# Altium schematic sheet 2_MCU.schdoc.schdoc
size 309 x 223 mm; Symbol: Sheet-Symbol_A4; Device: Sheet-Symbol_A4; Company: 嘉立创EDA; Drawed: 吴登珂; Version: V1.0; Page Size: A4; @Project Name: 最小系统板; @Page Count: 3; @Update Date: 2024-04-13; @Create Date: 2024-04-05; @Schematic Name: Schematic1; @Page No: 3; @Page Name: MCU
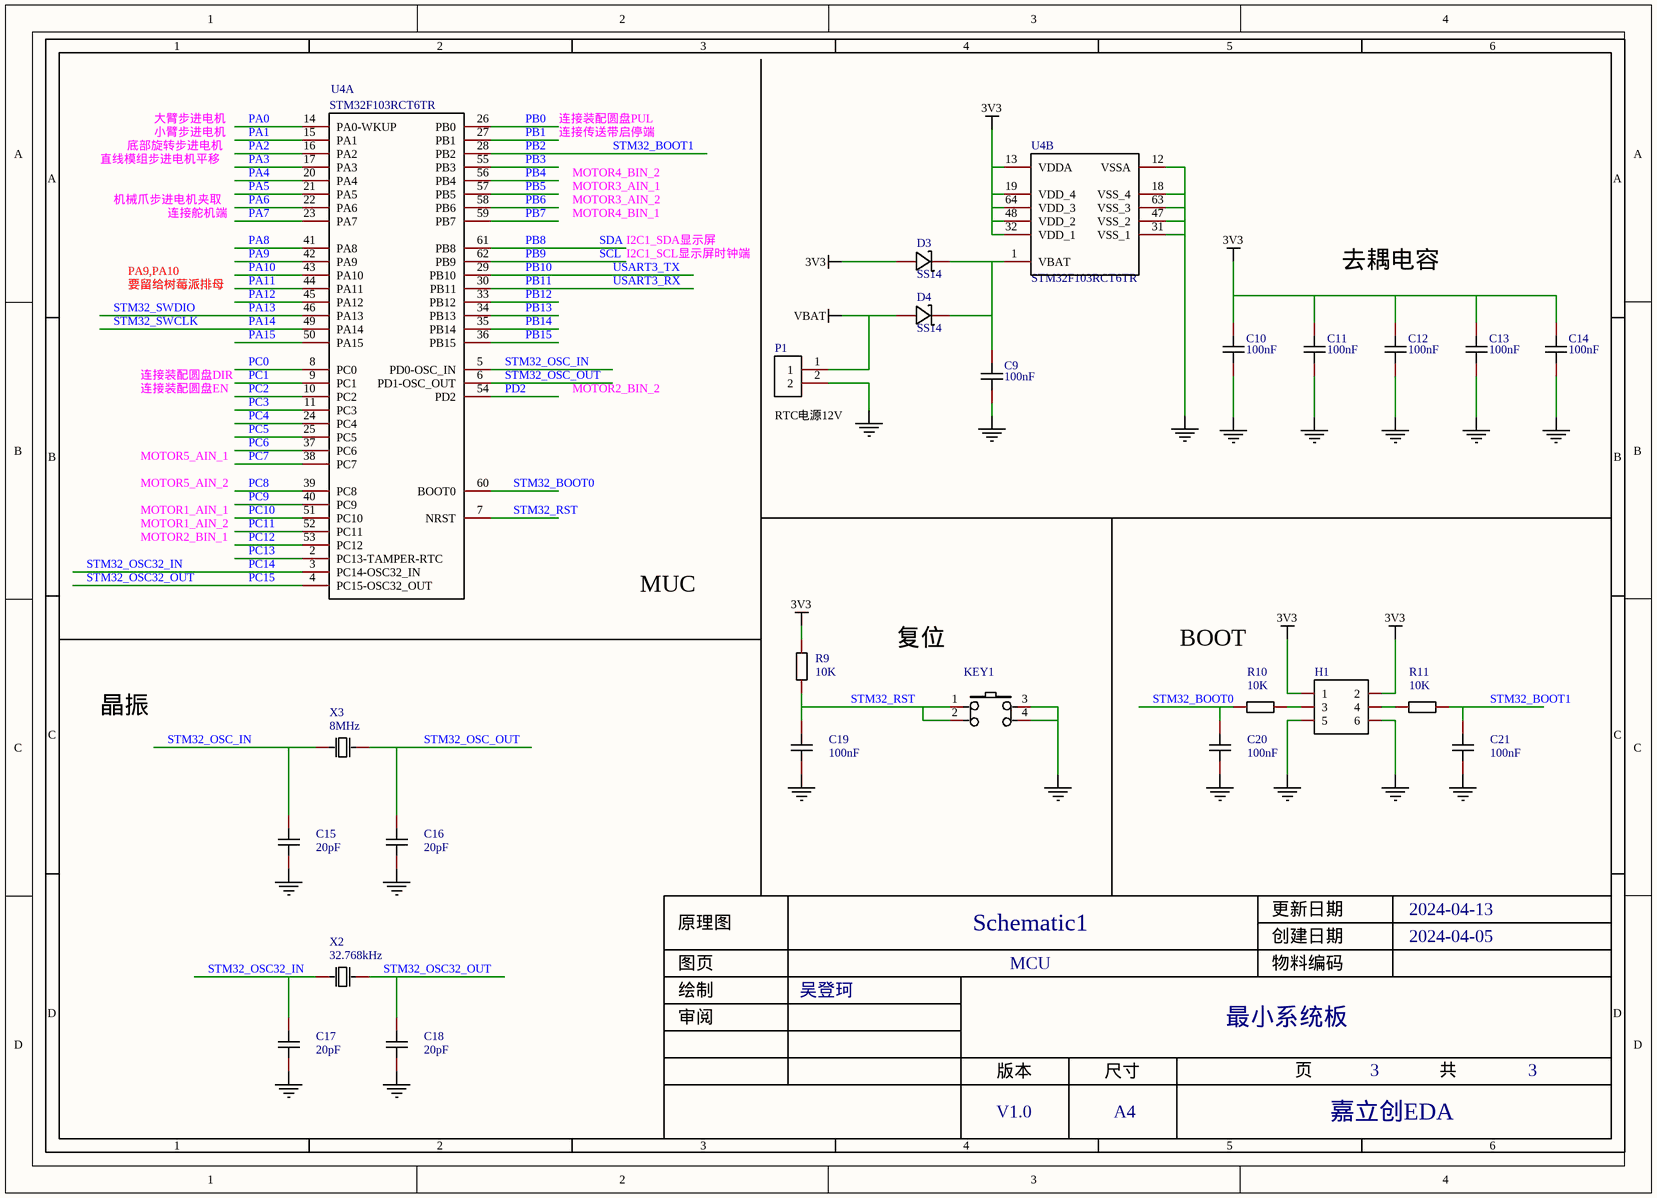
[diagram p0: 2_MCU.schdoc.schdoc]

## Parts
C9  100nF  [C0603]
C10  100nF  [C0603]
C11  100nF  [C0603]
C12  100nF  [C0603]
C13  100nF  [C0603]
C14  100nF  [C0603]
C15  20pF  [C0603]
C16  20pF  [C0603]
C17  20pF  [C0603]
C18  20pF  [C0603]
C19  100nF  [C0603]
C20  100nF  [C0603]
C21  100nF  [C0603]
D3  SS14  [SMA_L4.3-W2.6-LS5.2-RD]
D4  SS14  [SMA_L4.3-W2.6-LS5.2-RD]
H1  HDR-F_2.54_2x3  [HDR-TH_6P-P2.54-V-F-R2-C3-S2.54]  (value not drawn)
KEY1  6x6x6塑料头  [SW-SMD_4P-L6.0-W6.0-P4.50-LS8.6]  (value not drawn)
P1  WJ500V-5.08-2P  [CONN-TH_2P-P5.00_WJ500V-5.08-2P]  (value not drawn)
R9  10K  [R0603]
R10  10K  [R0603]
R11  10K  [R0603]
U4  STM32F103RCT6TR  [LQFP-64_L10.0-W10.0-P0.50-LS12.0-BL]  (parts A,B of 2)
X2  32.768kHz  [OSC-SMD_L3.2-W1.5]
X3  8MHz  [CRYSTAL-SMD_L5.0-W3.2]

## Nets
3V3: C10.2 C11.2 C12.2 C13.2 C14.2 D3.2(A) H1.1 H1.2 R9.2 U4.13(VDDA) U4.19(VDD_4) U4.32(VDD_1) U4.48(VDD_2) U4.64(VDD_3)
NetC9_1: C9.1 C10.1 C11.1 C12.1 C13.1 C14.1 C15.1 C16.1 C17.1 C18.1 C19.1 C20.1 C21.1 H1.5 H1.6 KEY1.3 KEY1.4 P1.2 U4.12(VSSA) U4.18(VSS_4) U4.31(VSS_1) U4.47(VSS_2) U4.63(VSS_3)
VBAT: D4.2(A) P1.1
PA0: U4.14(PA0-WKUP)
PA1: U4.15(PA1)
PA2: U4.16(PA2)
PA3: U4.17(PA3)
PA4: U4.20(PA4)
PA5: U4.21(PA5)
PA6: U4.22(PA6)
PA7: U4.23(PA7)
PA8: U4.41(PA8)
PA9: U4.42(PA9)
PA10: U4.43(PA10)
PA11: U4.44(PA11)
PA12: U4.45(PA12)
PA13: U4.46(PA13)  [also labelled STM32_SWDIO]
PA14: U4.49(PA14)  [also labelled STM32_SWCLK]
PA15: U4.50(PA15)
PB0: U4.26(PB0)
PB1: U4.27(PB1)
PB2: C21.2 R11.2 U4.28(PB2)  [also labelled STM32_BOOT1]
PB3: U4.55(PB3)
PB4: U4.56(PB4)
PB5: U4.57(PB5)
PB6: U4.58(PB6)
PB7: U4.59(PB7)
PB8: U4.61(PB8)  [also labelled SDA]
PB9: U4.62(PB9)  [also labelled SCL]
PB10: U4.29(PB10)  [also labelled USART3_TX]
PB11: U4.30(PB11)  [also labelled USART3_RX]
PB12: U4.33(PB12)
PB13: U4.34(PB13)
PB14: U4.35(PB14)
PB15: U4.36(PB15)
PC0: U4.8(PC0)
PC1: U4.9(PC1)
PC2: U4.10(PC2)
PC3: U4.11(PC3)
PC4: U4.24(PC4)
PC5: U4.25(PC5)
PC6: U4.37(PC6)
PC7: U4.38(PC7)
PC8: U4.39(PC8)
PC9: U4.40(PC9)
PC10: U4.51(PC10)
PC11: U4.52(PC11)
PC12: U4.53(PC12)
PC13: U4.2(PC13-TAMPER-RTC)
PC14: C17.2 U4.3(PC14-OSC32_IN) X2.1(OSC1)  [also labelled STM32_OSC32_IN]
PC15: C18.2 U4.4(PC15-OSC32_OUT) X2.2(OSC2)  [also labelled STM32_OSC32_OUT]
PD2: U4.54(PD2)
STM32_BOOT0: C20.2 R10.1 U4.60(BOOT0)
STM32_OSC_IN: C15.2 U4.5(PD0-OSC_IN) X3.1(OSC1)
STM32_OSC_OUT: C16.2 U4.6(PD1-OSC_OUT) X3.2(OSC2)
STM32_RST: C19.2 KEY1.1 KEY1.2 R9.1 U4.7(NRST)
NetC9_2: C9.2 D3.1(K) D4.1(K) U4.1(VBAT)
NetH1_3: H1.3 R10.2
NetH1_4: H1.4 R11.1

## Notes on the sheet
- 1
- 2
- 3
- 4
- 5
- 6
- A
- B
- C
- 原理图
- Schematic1
- 创建日期
- 更新日期
- 2024-04-13
- 2024-04-05
- D
- 审阅
- 绘制
- 图页
- 吴登珂
- MCU
- 物料编码
- 最小系统板
- 版本
- 尺寸
- 页
- 共
- V1.0
- A4
- 嘉立创EDA
- (in symbol WJ500V-5.08-2P) 大臂步进电机; 连接装配圆盘PUL; 小臂步进电机; 连接传送带启停端; 底部旋转步进电机; 直线模组步进电机平移; MOTOR4_BIN_2; MOTOR3_AIN_1; 机械爪步进电机夹取; MOTOR3_AIN_2; 连接舵机端; MOTOR4_BIN_1; I2C1_SDA显示屏; PA9,PA10 / 要留给树莓派排母; I2C1_SCL显示屏时钟端; 去耦电容; 连接装配圆盘DIR; 连接装配圆盘EN; MOTOR2_BIN_2; RTC电源12V; MOTOR5_AIN_1; MOTOR5_AIN_2; MOTOR1_AIN_1; MOTOR1_AIN_2; MOTOR2_BIN_1; MUC; 复位; BOOT; 晶振

## Library data of the parts
C9-C21 = CAP_0603: Symbol: CapAcitance; Convert to PCB: yes; Device: CAP_0603; Add into BOM: yes; Supplier Footprint: 0603
  C9-C14 C19-C21: Name: 100nF; Value: 100nF
  C15-C18: Name: 20pF; Value: 20pF
D3 D4 = SS14_C83852: Manufacturer: onsemi(安森美); Add into BOM: yes; Forward Voltage (Vf@If): 500mV@1A; Reverse Voltage (Vr): 40V; Average Rectified Current (Io): 1A; Reverse Leakage Current (Ir): 200uA@40V; Description: 正向压降(Vf):500mV@1A;直流反向耐压(Vr):40V;平均整流电流(Io):1A;; Name: SS14; Symbol: SS14_C83852; Device: SS14_C83852; Supplier: LCSC; Supplier Part: C83852; Manufacturer Part: SS14; JLCPCB Part Class: 扩展库; LCSC Part Name: 电压:40V 电流:1A; Supplier Footprint: SMA(DO-214AC); Datasheet: https://atta.szlcsc.com/upload/public/pdf/source/20181222/C83852_041FE29A925F1DAA7D9CB1F1C69076C2.pdf; Convert to PCB: yes
H1 = HDR-F_2.54_2x3: Symbol: HDR-F-2.54_2x3; Convert to PCB: yes; Device: HDR-F_2.54_2x3; Add into BOM: yes; Supplier Part: C92272; Supplier Footprint: 插件
KEY1 = 6x6x6塑料头: Manufacturer: 国产; Symbol: 6x6x6Plastic head; Add into BOM: yes; Switch Length: 6mm; Description: 开关长度:6mm;开关宽度:6mm;开关高度:6mm;机械寿命:-;; Name: 6x6x6塑料头; Device: 6x6x6塑料头; Supplier Part: C23550; Supplier: LCSC; Manufacturer Part: 6x6x6塑料头; JLCPCB Part Class: 扩展库; LCSC Part Name: 6x6x6 塑料头; Supplier Footprint: SMD; Datasheet: https://atta.szlcsc.com/upload/public/pdf/source/20150923/1457707411939.pdf; Convert to PCB: yes; Switch Width: 6mm; Switch Height: 6mm; Mechanical Life: -
P1 = WJ500V-5.08-2P: Manufacturer: KANGNEX(康奈克斯电气); Symbol: WJ500V-5.08-2P-14-00A; Add into BOM: yes; Structure: 1x2P; Pitch: 5.08mm; Current Rating (Max): 18A; Voltage Rating (Max): 250V; Wire Gauge - AWG: 14~30; Wire Gauge - mm2: 2.5; Number of PINs Per Row: 2; Description: 结构:1x2P;间距:5.08mm;颜色:绿色;安装方式:直插;额定电流:18A;额定电压:250V;排数:1;线规 - AWG:14~30;线规 - 平方毫米:2.5;每排PIN数:2;工作温度范围:-40℃~+105℃;; Name: WJ500V-5.08-2P; Device: WJ500V-5.08-2P; Supplier: LCSC; Manufacturer Part: WJ500V-5.08-2P; Supplier Part: C8465; JLCPCB Part Class: 扩展库; LCSC Part Name: 5.08mm 1x2P 排数:1 每排P数:2 直插; Supplier Footprint: 插件,P=5.08mm; Datasheet: https://atta.szlcsc.com/upload/public/pdf/source/20191225/C8465_02D34CE5B5B4A53DF5891601D97FA9F4.pdf; Convert to PCB: yes; Color: 绿色; Mounting Style: 直插; Number of Pins: 2P; Number of Rows: 1; Operating Temperature Range: -40℃~+105℃
R9-R11 = Res_0603: Symbol: 电阻; Convert to PCB: yes; Name: 10K; Device: Res_0603; Add into BOM: yes; Supplier Footprint: 0603; Value: 10K
U4 = STM32F103RCT6TR: Manufacturer: ST(意法半导体); Add into BOM: yes; CPU Core: CM3; Program Storage Size: 256KB; RAM Size: 48KB; GPIO Ports Number: 51; Operating Voltage Range: 2V~3.6V; CPU Maximum Speed: 72MHz; Program Memory Type: FLASH; ADC (Bit): 12bit; Universal Serial Bus: 有; Peripheral/Function: 看门狗；DMA；看门狗；片载温度传感器; Description: CPU内核:CM3;程序存储容量:256KB;RAM总容量:48KB;GPIO端口数量:51;工作电压范围:2V~3.6V;CPU最大主频:72MHz;程序存储器类型:FLASH;; Name: STM32F103RCT6TR; Symbol: STM32F103RCT6TR; Device: STM32F103RCT6TR; LCSC Part Name: STM32F103RCT6TR; Supplier Part: C39704; Manufacturer Part: STM32F103RCT6TR; Supplier Footprint: LQFP-64(10x10); JLCPCB Part Class: 扩展库; Datasheet: https://atta.szlcsc.com/upload/public/pdf/source/20151012/1457707442737.pdf; Supplier: LCSC; Convert to PCB: yes; Operating Temperature Range: -40℃~+85℃; DAC (Bit): 12bit; PWM (Bit): -; Internal Comparator: -; communication protocol: -; Watchdog: 有; Real-Time Clock: -; Infrared Data Association: 有; Low-Voltage Detect: 有; CCP Capture/Compare: -; Secure Digital Input and Output: -; Direct Memory Access: 有; Internal Oscillator: 有
X2 = DST310S 32.768KHz: Manufacturer: KDS(大真空); Add into BOM: yes; Description: 晶振类型:-;频率:-;外接负载电容:-;; Name: 32.768kHz; Symbol: DST310S 32.768KHz; Device: DST310S 32.768KHz; LCSC Part Name: 32.768KHz 12.5PF 20ppm; Supplier Part: C93232; Manufacturer Part: DST310S 32.768KHz; Supplier Footprint: SMD3215-2P; JLCPCB Part Class: 扩展库; Datasheet: https://atta.szlcsc.com/upload/public/pdf/source/20170919/C93232_1505799689477977622.pdf; Supplier: LCSC; Convert to PCB: yes; Crystal Type: -; Value: 32.768kHz; External load capacitor: -; Operating Temperature: -
X3 = X50328MSB2GI: Manufacturer: YXC(扬兴晶振); Add into BOM: yes; Crystal Type: 贴片晶振; Normal temperature Frequency Tolerance: ±10ppm; External load capacitor: 20pF; Frequency Stability(Full temperature range): ±20ppm; Description: 晶振类型:贴片晶振;频率:8MHz;常温频差:±10ppm;外接负载电容:20pF;频率稳定度(全温):±20ppm;; Name: 8MHz; Symbol: X50328MSB2GI; Device: X50328MSB2GI; LCSC Part Name: 8MHz ±10ppm 20pF YSX530GA; Supplier Part: C115962; Manufacturer Part: X50328MSB2GI; Supplier Footprint: SMD5032; JLCPCB Part Class: 基础库; Datasheet: https://atta.szlcsc.com/upload/public/pdf/source/20240329/44922B0AF7B60E58E9B66993B6077277.pdf; Supplier: LCSC; Convert to PCB: yes; Value: 8MHz; Operating Temperature: -40℃~+85℃